# EAGLE schematic tractor_1v6 (EAGLE 9.0.1)
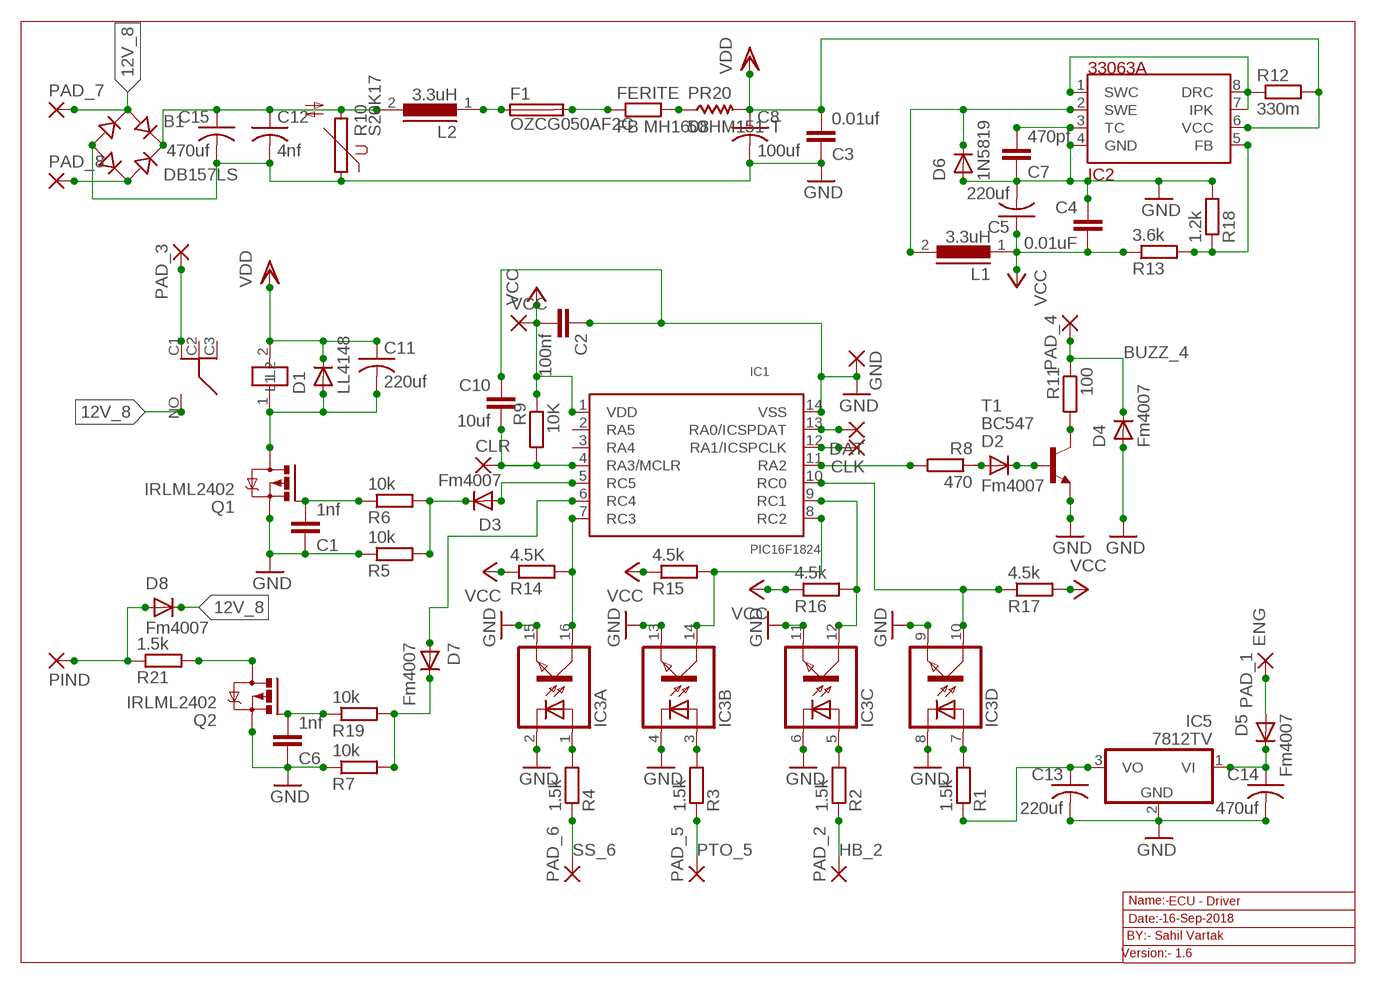
[diagram p0: schematic, sheet 1]

## Parts
B1  DB157LS  DBS106G  [DBS]
C1  1nf  CC0603  [C0603]
C2  100nf  CC0603  [C0603]
C3  0.01uf  CC0603  [C0603]
C4  0.01uF  CC0603  [C0603]
C5  220uf  C-US025-025X050  [C025-025X050]
C6  1nf  CC0603  [C0603]
C7  470pf  CC0603  [C0603]
C8  100uf  C-US025-025X050  [C025-025X050]
C10  10uf  CC0603  [C0603]
C11  220uf  C-US025-025X050  [C025-025X050]
C12  4nf  C-US050-045X075  [C050-045X075]
C13  220uf  C-US025-025X050  [C025-025X050]
C14  470uf  C-US050-075X075  [C050-075X075]
C15  470uf  C-US050-075X075  [C050-075X075]
CLK  1,6/0,8  [1,6/0,8]
CLR  1,6/0,8  [1,6/0,8]
D1  LL4148  GF1  [SMA-DO214AC]
D2  Fm4007  GF1  [SMA-DO214AC]
D3  Fm4007  GF1  [SMA-DO214AC]
D4  Fm4007  GF1  [SMA-DO214AC]
D5  Fm4007  GF1  [SMA-DO214AC]
D6  1N5819  GF1  [SMA-DO214AC]
D7  Fm4007  GF1  [SMA-DO214AC]
D8  Fm4007  GF1  [SMA-DO214AC]
DAT  1,6/0,8  [1,6/0,8]
F1  OZCG050AF2C  RES_FUSE  [RES_FUSE]
FERITE  FB MH1608HM151-T  R-EU_R0603  [R0603]
GND  1,6/0,8  [1,6/0,8]
IC1  PIC16F1824  [SO-14]
IC2  33063A  [D_R-PDSO-G8]
IC3  TLP283-4  [MINI-FLAT-16]
IC5  7812TV  [TO220V]
K2  RL703  [RL703]
L1  3.3uH  82114R  [82114R]
L2  3.3uH  82114R  [82114R]
PAD_1  2,54/1,1  [2,54/1,1]
PAD_2  2,54/1,1  [2,54/1,1]
PAD_3  2,54/1,1  [2,54/1,1]
PAD_4  2,54/1,1  [2,54/1,1]
PAD_5  2,54/1,1  [2,54/1,1]
PAD_6  2,54/1,1  [2,54/1,1]
PAD_7  2,54/1,1  [2,54/1,1]
PAD_8  2,54/1,1  [2,54/1,1]
PIND  2,54/1,1  [2,54/1,1]
PR20  50  R-US_WSC2515  [WSC2515]
Q1  IRLML2402  IRLML5203  [MICRO3]
Q2  IRLML2402  IRLML5203  [MICRO3]
R1  1.5k  RR0603  [R0603]
R2  1.5k  RR0603  [R0603]
R3  1.5k  RR0603  [R0603]
R4  1.5k  RR0603  [R0603]
R5  10k  RR0603  [R0603]
R6  10k  RR0603  [R0603]
R7  10k  RR0603  [R0603]
R8  470  RR0603  [R0603]
R9  10K  RR0603  [R0603]
R10  S20K17  S14K17  [S14K17]
R11  100  RR0603  [R0603]
R12  330m  RR3216  [R3216]
R13  3.6k  RR0603  [R0603]
R14  4.5K  RR0603  [R0603]
R15  4.5k  RR0603  [R0603]
R16  4.5k  RR0603  [R0603]
R17  4.5k  RR0603  [R0603]
R18  1.2k  RR0603  [R0603]
R19  10k  RR0603  [R0603]
R21  1.5k  RR0603  [R0603]
T1  BC547  [TO92]
VCC  1,6/0,8  [1,6/0,8]

## Nets
12V_8: B1.AC1 D8.K(C) K2.NO PAD_7.1(P)
BUZZ_4: D4.K(C) PAD_4.1(P) R11.1
ENG: D5.A PAD_1.1(P)
GND: B1.- C1.1 C2.1 C3.1 C4.1 C5.2 C6.1 C7.1 C8.2 C10.1 C12.2 C13.2 C14.2 C15.2 D4.A D6.A GND.1(P) IC1.14(VSS) IC2.4(GND) IC3.2(A:C) IC3.4(B:C) IC3.6(C:C) IC3.8(D:C) IC3.9(D:EMIT) IC3.11(C:EMIT) IC3.13(B:EMIT) IC3.15(A:EMIT) IC5.2(GND) Q1.2(S) Q2.2(S) R5.1 R7.1 R10.1 R18.2 T1.1(E)
HB_2: PAD_2.1(P) R2.1
N$1: B1.AC2 PAD_8.1(P)
N$3: IC1.10(RC0) IC3.10(D:COL) R17.1
N$5: C11.2 D1.A K2.1(L2) Q1.3(D)
N$7: D2.A R8.1
N$8: DAT.1(P) IC1.13(RA0/ICSPDAT)
N$9: CLK.1(P) IC1.12(RA1/ICSPCLK)
N$13: C14.1 D5.K(C) IC5.1(VI)
N$14: D2.K(C) T1.2(B)
N$15: FERITE.2 PR20.1
N$16: C13.1 IC5.3(VO) R1.1
N$17: D3.A IC1.5(RC5)
N$18: IC2.1(SWC) IC2.7(IPK) IC2.8(DRC) R12.1
N$19: C7.2 IC2.3(TC)
N$20: F1.2 FERITE.1
N$21: F1.1 L2.1
N$22: D6.K(C) IC2.2(SWE) L1.2
N$23: IC2.5(FB) R13.2 R18.1
N$24: C6.2 Q2.1(G) R19.1
N$25: Q2.3(D) R21.2
N$26: D7.K(C) R7.2 R19.2
N$27: D7.A IC1.6(RC4)
N$28: D8.A PIND.1(P) R21.1
N$29: B1.+ C12.1 C15.1 L2.2 R10.2
N$72: C1.2 Q1.1(G) R6.1
N$74: D3.K(C) R5.2 R6.2
N$76: IC3.1(A:A) R4.2
N$78: IC3.3(B:A) R3.2
N$80: IC3.5(C:A) R2.2
N$82: IC3.7(D:A) R1.2
N$84: IC1.9(RC1) IC3.12(C:COL) R16.2
N$85: IC1.8(RC2) IC3.14(B:COL) R15.2
N$86: IC1.7(RC3) IC3.16(A:COL) R14.2
N$87: C10.2 CLR.1(P) IC1.4(RA3/MCLR) R9.2
N$88: IC1.11(RA2) R8.2
N$90: R11.2 T1.3(C)
PTO_5: PAD_5.1(P) R3.1
R_3: K2.C1 PAD_3.1(P)
SS_6: PAD_6.1(P) R4.1
VCC: C2.2 C4.2 C5.1 IC1.1(VDD) L1.1 R9.1 R13.1 R14.1 R15.1 R16.1 R17.2 VCC.1(P)
VDD: C3.2 C8.1 C11.1 D1.K(C) IC2.6(VCC) K2.2(L1) PR20.2 R12.2
Unconnected: IC1.2(RA5) IC1.3(RA4) K2.C2 K2.C3

## Notes on the sheet
- Name:- | ECU - Driver
- Date:- | 16-Sep-2018
- BY:- Sahil Vartak
- Version:- 1.6

## Library data of the parts
B1 = rectifier:DB?*G: Single Phase 1.0 AMP Glass Passivated Bridge Rectifier Taiwan Semiconductor Co.,Ltd. - TSC Source: http://www.taiwansemi.com/TSCbig5/ezcatfiles/cust/img/img/db101g.pdf http://www.ts.com.tw/db/pictures/modules/PDT/PDT060207001/DBLS201G.pdf
C1-C4 C6 C7 C10 = eagle-ltspice:C: CAPACITOR, European symbol; SPICEMODEL: NONE; SPICEPREFIX: C
C5 C8 C11-C13 = rcl:C-US: CAPACITOR, American symbol
C14 C15 = resistor:C-US: CAPACITOR, American symbol
CLK CLR DAT GND VCC = wirepad:1,6/0,8: THROUGH-HOLE PAD
D1-D8 = diode:GF1: DIODE
F1 = fuse:RES_FUSE
FERITE = resistor:R-EU_: RESISTOR, European symbol
IC1 = microchip:PIC16F1824
IC2 = linear:33063A
IC3 = optocoupler:TLP283-4: TOSHIBA PHOTOCOUPLER GaAs IRED & PHOTO-TRANSISTOR Source: http://www.semicon.toshiba.co.jp/td/en/Opto/Photocoupler/en_20050928_TLP283_datasheet.pdf; OC_FARNELL: unknown; OC_NEWARK: unknown
IC5 = linear:78*: Positive VOLTAGE REGULATOR Source: http://cache.national.com/ds/LM/LM78L05.pdf http://www.fairchildsemi.com/ds/LM/LM7805.pdf
K2 = relay:RL703
L1 L2 = inductors:82114R: INDUCTOR; SPICEPREFIX: L
PAD_1-PAD_8 PIND = wirepad:2,54/1,1: THROUGH-HOLE PAD
PR20 = resistor:R-US_: RESISTOR, American symbol
Q1 Q2 = transistor-power:IRLML5203: HEXFET P-Channel Power MOSFET
R1-R9 R11-R19 R21 = eagle-ltspice:R: RESISTOR, European symbol; SPICEMODEL: NONE; SPICEPREFIX: R
R10 = varistor:S14K17: VARISTOR
T1 = transistor-neu-to92:BC547: NPN TRANSISTOR